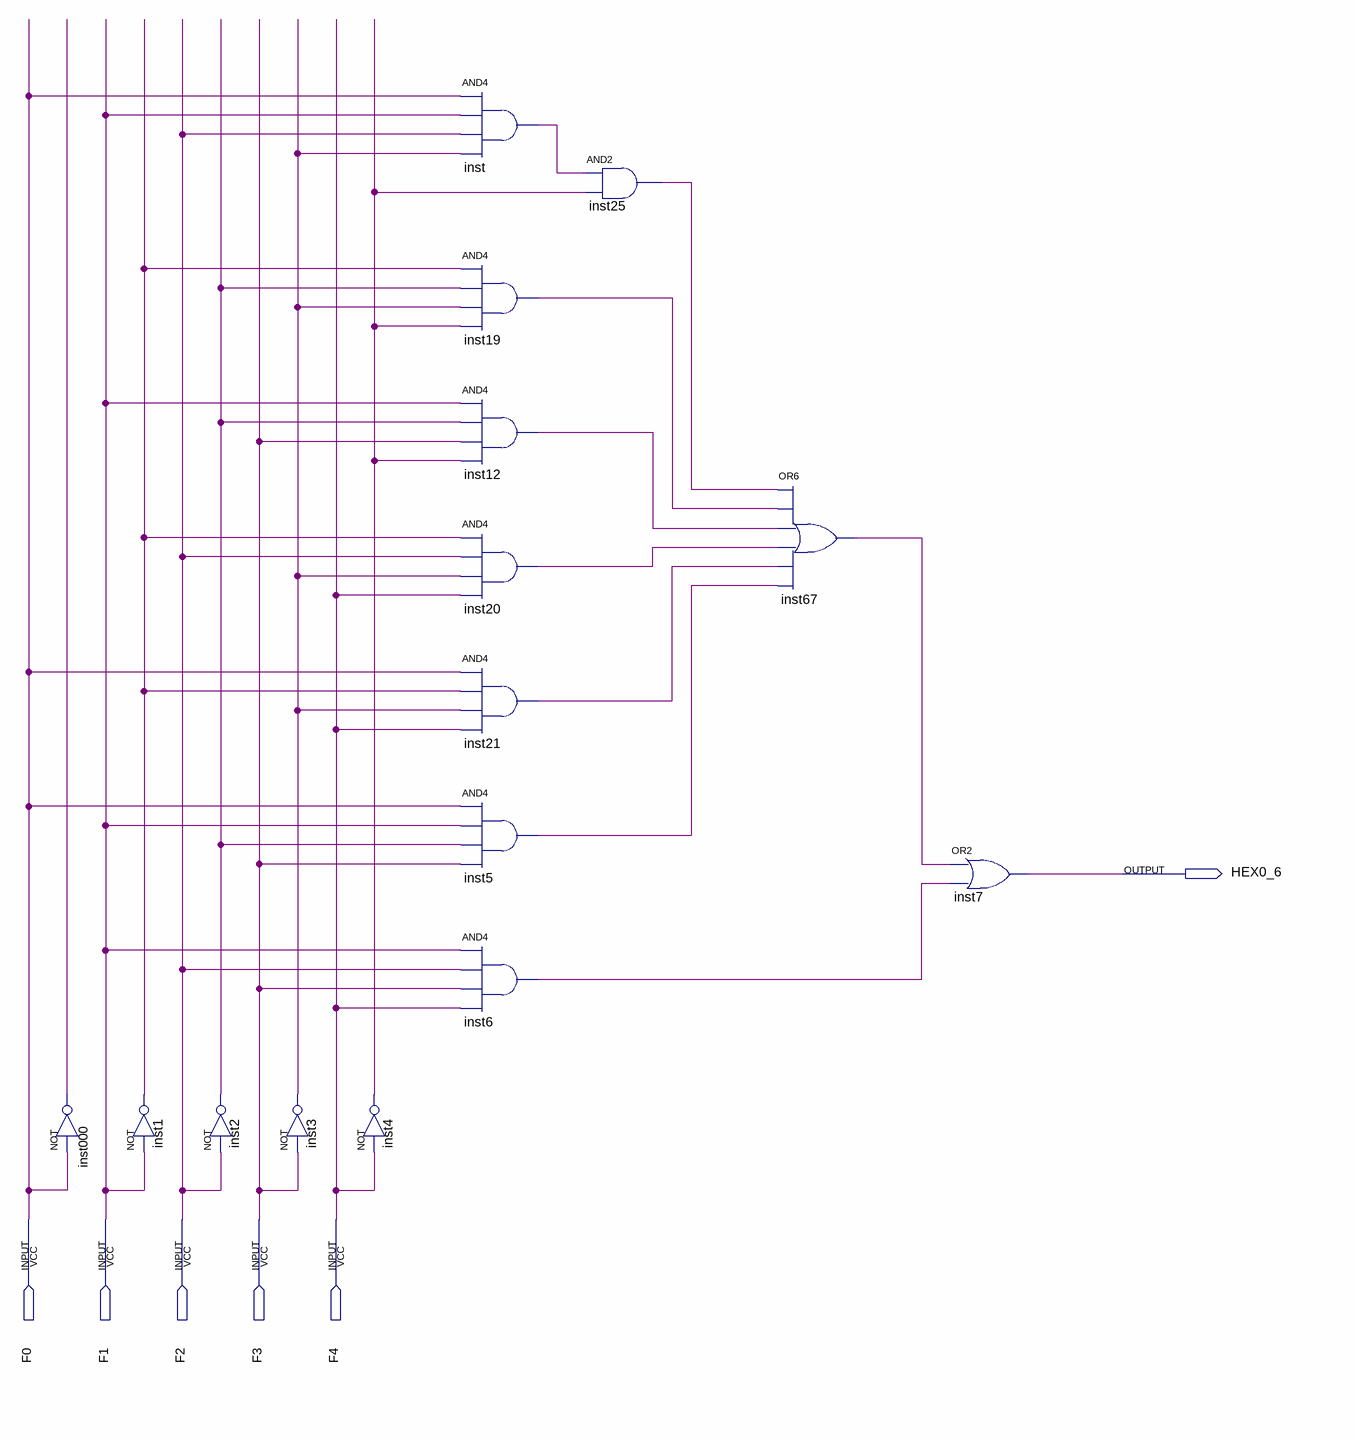
[diagram p0: schematic sheet]
// Quartus schematic HEX06.bdf as structural Verilog: 15 symbols, 6 pins
module HEX06 (
  input  F0,
  input  F1,
  input  F2,
  input  F3,
  input  F4,
  output HEX0_6
);

  wire inst000_out, inst1_out, inst2_out, inst3_out, inst4_out, inst5_out, inst6_out, inst12_out, inst19_out,
       inst20_out, inst21_out, inst25_out, inst67_out, inst_out;

  not inst000 (inst000_out, F0);
  not inst1 (inst1_out, F1);
  not inst2 (inst2_out, F2);
  not inst3 (inst3_out, F3);
  not inst4 (inst4_out, F4);
  and inst (inst_out, F0, F1, F2, inst3_out);
  and inst19 (inst19_out, inst1_out, inst2_out, inst3_out, inst4_out);
  and inst12 (inst12_out, F1, inst2_out, F3, inst4_out);
  and inst20 (inst20_out, inst1_out, F2, inst3_out, F4);
  and inst21 (inst21_out, F0, inst1_out, inst3_out, F4);
  and inst5 (inst5_out, F0, F1, inst2_out, F3);
  and inst6 (inst6_out, F1, F2, F3, F4);
  and inst25 (inst25_out, inst_out, inst4_out);
  or inst67 (inst67_out, inst25_out, inst19_out, inst12_out, inst20_out, inst21_out, inst5_out);
  or inst7 (HEX0_6, inst67_out, inst6_out);
endmodule
